# EAGLE design xo106 (EAGLE 7.7.0)
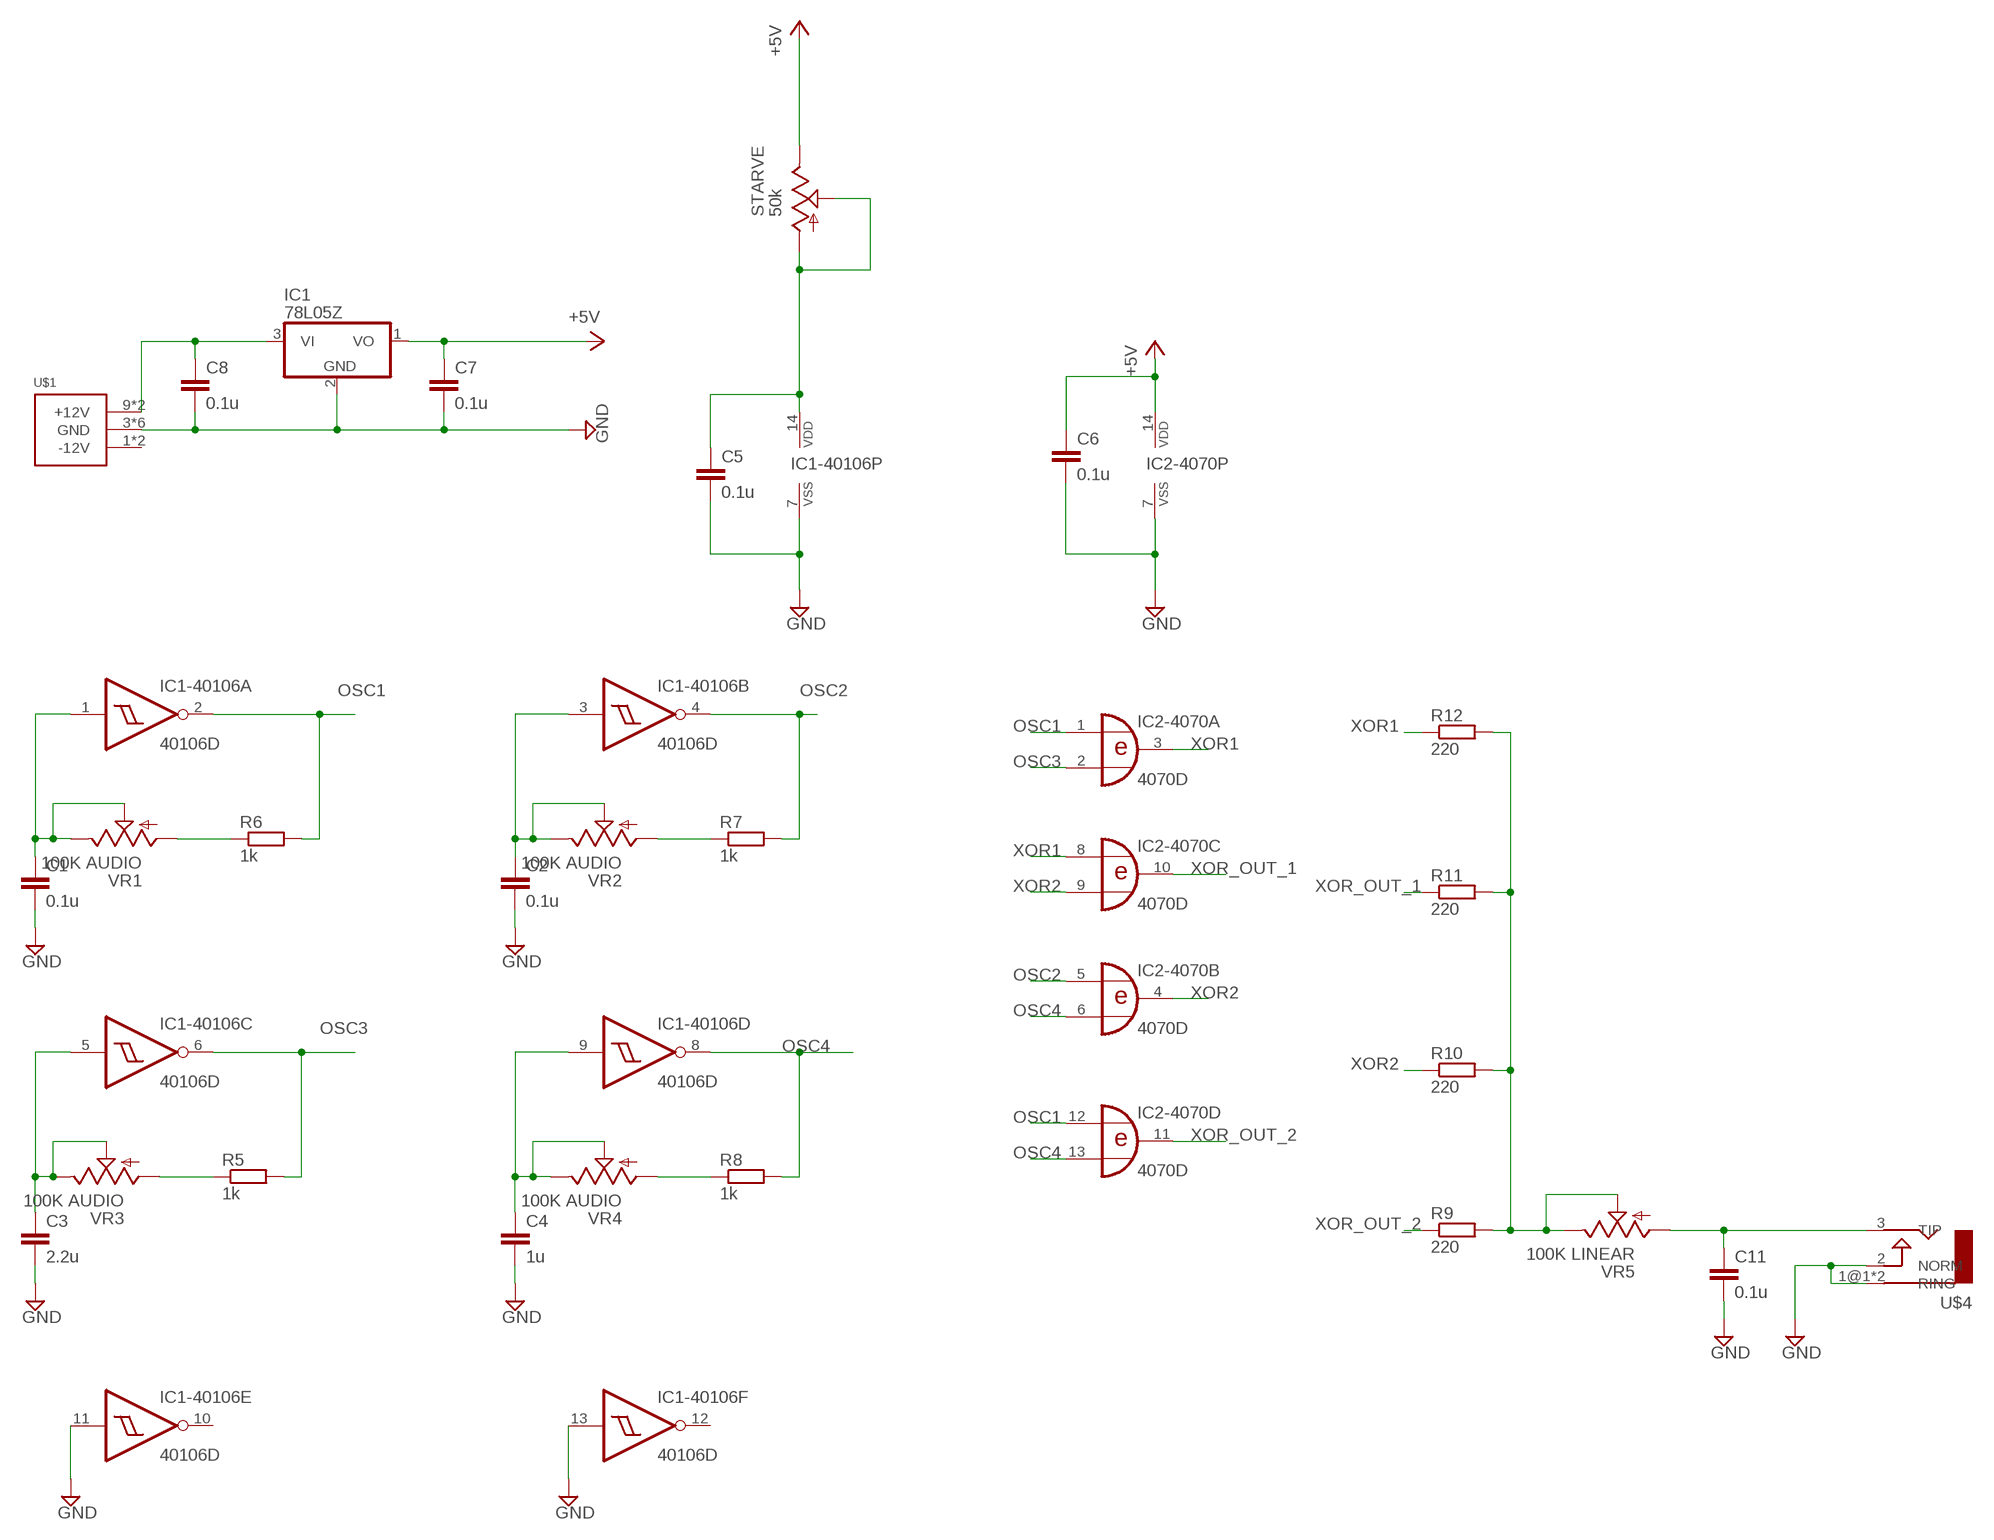
[diagram p0: schematic, sheet 1]

## Parts
C1  0.1u  C-EUC0805  [C0805]
C2  0.1u  C-EUC0805  [C0805]
C3  2.2u  C-EUC0805  [C0805]
C4  1u  C-EUC0805  [C0805]
C5  0.1u  C-EUC0805  [C0805]
C6  0.1u  C-EUC0805  [C0805]
C7  0.1u  C-EUC0805  [C0805]
C8  0.1u  C-EUC0805  [C0805]
C11  0.1u  C-EU050-025X075  [C050-025X075]
IC1  78L05Z  [TO92]
IC1-40106  40106D  [SO14]
IC2-4070  4070D  [SO14]
R5  1k  R-EU_R0805  [R0805]
R6  1k  R-EU_R0805  [R0805]
R7  1k  R-EU_R0805  [R0805]
R8  1k  R-EU_R0805  [R0805]
R9  220  R-EU_R0805  [R0805]
R10  220  R-EU_R0805  [R0805]
R11  220  R-EU_R0805  [R0805]
R12  220  R-EU_R0805  [R0805]
STARVE  50k  9MM_SNAP-IN_POT_  [9MM_SNAP-IN_POT]
U$1  POWER_SIMPLE10  [POWER_10]
U$4  AUDIO-JACKERTHENVAR  [ERTHENVAR-JACK]
VR1  100K AUDIO  9MM_SNAP-IN_POT_  [9MM_SNAP-IN_POT]
VR2  100K AUDIO  9MM_SNAP-IN_POT_  [9MM_SNAP-IN_POT]
VR3  100K AUDIO  9MM_SNAP-IN_POT_  [9MM_SNAP-IN_POT]
VR4  100K AUDIO  9MM_SNAP-IN_POT_  [9MM_SNAP-IN_POT]
VR5  100K LINEAR  9MM_SNAP-IN_POT_  [9MM_SNAP-IN_POT]

## Nets
+5V: C6.1 C7.1 IC1.1(VO) IC2-4070.14(P:VDD) STARVE.3(E)
GND: C1.2 C2.2 C3.2 C4.2 C5.2 C6.2 C7.2 C8.2 C11.2 IC1-40106.7(P:VSS) IC1-40106.11(E:I) IC1-40106.13(F:I) IC1.2(GND) IC2-4070.7(P:VSS) U$1.3(GND) U$1.4(GND) U$1.5(GND) U$1.6(GND) U$1.7(GND) U$1.8(GND) U$4.1@1(RING) U$4.1@2(RING) U$4.2(NORM)
N$1: C11.1 U$4.3(TIP) VR5.1(A)
N$2: R6.1 VR1.1(A)
N$3: R5.1 VR3.1(A)
N$4: R8.1 VR4.1(A)
N$5: C1.1 IC1-40106.1(A:I) VR1.2(S) VR1.3(E)
N$6: C2.1 IC1-40106.3(B:I) VR2.2(S) VR2.3(E)
N$7: C3.1 IC1-40106.5(C:I) VR3.2(S) VR3.3(E)
N$8: C4.1 IC1-40106.9(D:I) VR4.2(S) VR4.3(E)
N$9: R7.1 VR2.1(A)
N$10: C8.1 IC1.3(VI) U$1.9(+12V) U$1.10(+12V)
N$11: C5.1 IC1-40106.14(P:VDD) STARVE.1(A) STARVE.2(S)
N$15: R9.2 R10.2 R11.2 R12.2 VR5.2(S) VR5.3(E)
OSC1: IC1-40106.2(A:O) IC2-4070.1(A:I0) IC2-4070.12(D:I0) R6.2
OSC2: IC1-40106.4(B:O) IC2-4070.5(B:I0) R7.2
OSC3: IC1-40106.6(C:O) IC2-4070.2(A:I1) R5.2
OSC4: IC1-40106.8(D:O) IC2-4070.6(B:I1) IC2-4070.13(D:I1) R8.2
XOR1: IC2-4070.3(A:O) IC2-4070.8(C:I0) R12.1
XOR2: IC2-4070.4(B:O) IC2-4070.9(C:I1) R10.1
XOR_OUT_1: IC2-4070.10(C:O) R11.1
XOR_OUT_2: IC2-4070.11(D:O) R9.1
Unconnected: IC1-40106.10(E:O) IC1-40106.12(F:O) U$1.1(-12V) U$1.2(-12V)

## Library data of the parts
C1-C8 C11 = rcl:C-EU: CAPACITOR, European symbol
IC1 = linear:78*: Positive VOLTAGE REGULATOR Source: http://cache.national.com/ds/LM/LM78L05.pdf http://www.fairchildsemi.com/ds/LM/LM7805.pdf
IC1-40106 = 40xx:40106: Hex SCHMITT TRIGGER
IC2-4070 = 40xx:4070: Quad 2-input XOR
R5-R12 = resistor:R-EU_: RESISTOR, European symbol
STARVE VR1-VR5 = MusicThingModular:9MM_SNAP-IN_POT: 9mm vertical snap-in pot, Alpha / Panasonic style
U$1 = eurorack:POWER_SIMPLE
U$4 = erthenvar:AUDIO-JACK: Switching Mono 3.5mm Audio Jack from Erthenvar.

## Board
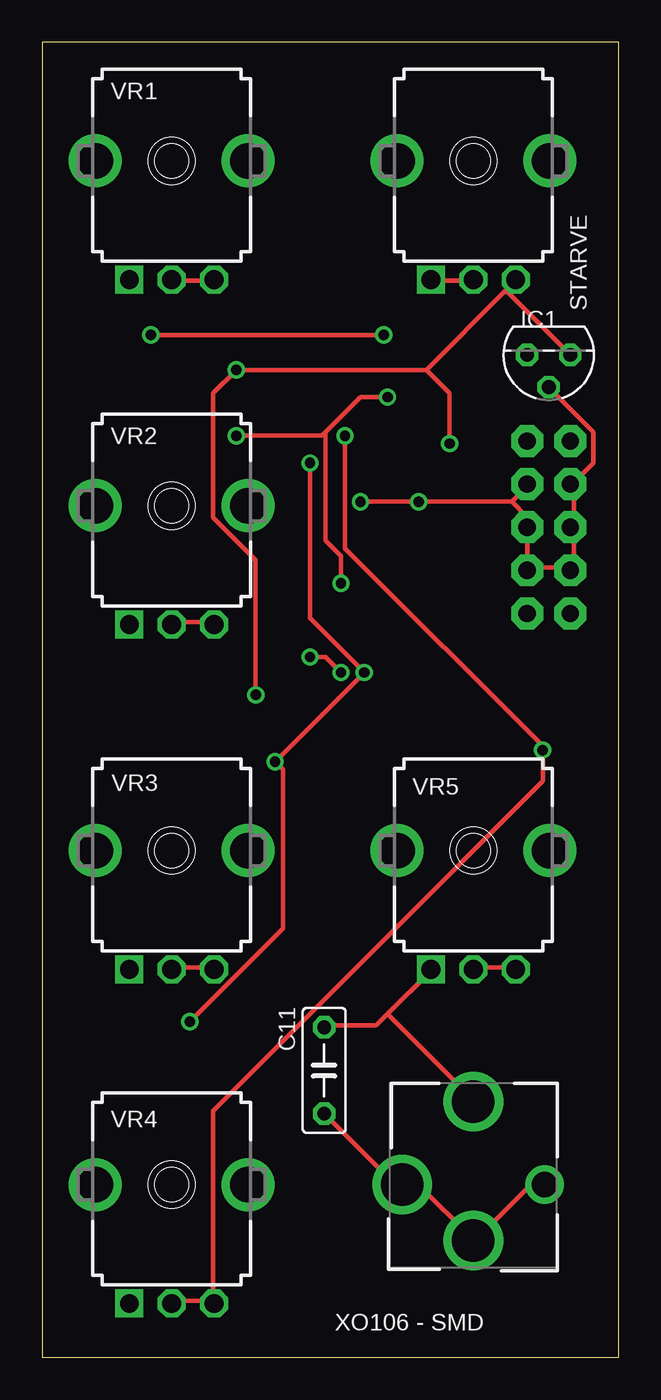
[diagram p1: board, top side]
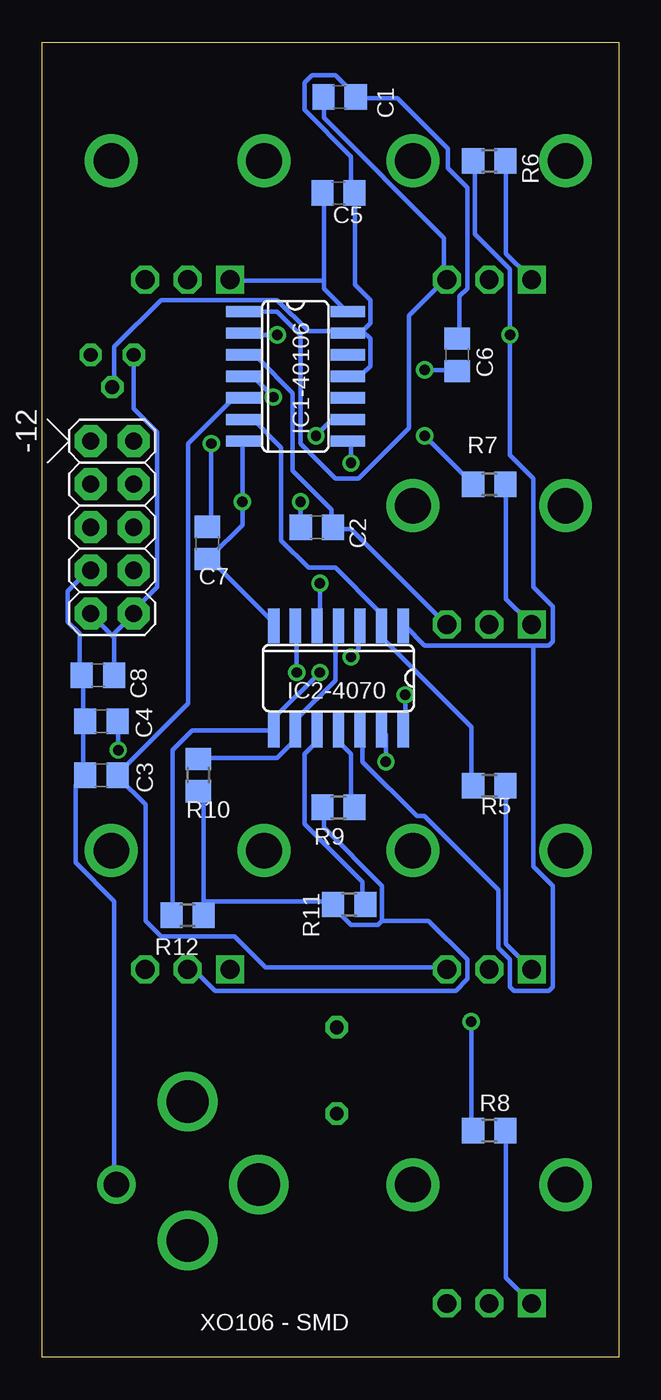
[diagram p2: board, bottom side, seen from below]

Size 33.96 x 77.46 mm. Coordinates in mm from the lower left corner, seen from the top.
Outline: 0,0 33.96,0 33.96,77.46 0,77.46 0,0
Copper layers (1*16): Top 0.035mm / dielectric 1.5mm / Bottom 0.035mm
Design rules "default": minimum track width 10mil, minimum drill 24mil, track to track 8mil, track to pad 8mil, pad to pad 8mil, via to via 8mil, smd to smd 8mil, copper to edge 40mil, drill to drill 8mil, minimum pad ring 10mil, minimum via ring 8mil, stop-mask expansion 4mil, vias tented up to drill 0mil, thermal gap 10mil

### Footprints (pad centres in the part's own frame; a part is rotated, then mirrored left to right if it is on the bottom)
C0805 = smd 1.3 x 1.5: 1 -0.95,0; 2 0.95,0
C050-025X075 = drill 0.813 octagon: 1 -2.54,0; 2 2.54,0
TO92 = drill 0.813 octagon: 1 -1.27,0; 2 0,1.905; 3 1.27,0
SO14 = smd 0.66 x 2.032: 1 -3.81,-3.073; 2 -2.54,-3.073; 3 -1.27,-3.073; 4 0,-3.073; 5 1.27,-3.073; 6 2.54,-3.073; 7 3.81,-3.073; 8 3.81,3.073; 9 2.54,3.073; 10 1.27,3.073; 11 0,3.073; 12 -1.27,3.073; 13 -2.54,3.073; 14 -3.81,3.073
R0805 = smd 1.3 x 1.5: 1 -0.95,0; 2 0.95,0
9MM_SNAP-IN_POT = drill 1.1 square: 1 -2.5,-7 | drill 1.1 octagon: 2 0,-7; 3 2.5,-7 | drill 2.1 pad 2.794: CHASSIS1 -4.5,0; CHASSIS2 4.5,0
POWER_10 = drill 1.016 pad 1.88 octagon: 1 -5.08,-1.27; 2 -5.08,1.27; 3 -2.54,-1.27; 4 -2.54,1.27; 5 0,-1.27; 6 0,1.27; 7 2.54,-1.27; 8 2.54,1.27; 9 5.08,-1.27; 10 5.08,1.27
ERTHENVAR-JACK = drill 2.5: 1@1 -4.2,0; 2 0,-3.3; 3 0,4.9 | drill 1.5: 1@2 4.2,0

### Placement (x,y rotation side)
C1  16.44,74.25 0 bottom
C2  17.78,48.89 180 bottom
C3  30.48,34.29 180 bottom
C4  30.48,37.46 180 bottom
C5  16.51,68.58 0 bottom
C6  9.53,59.05 90 bottom
C7  24.23,47.97 270 bottom
C8  30.69,40.17 180 bottom
C11  16.61,16.89 270 top
IC1  29.84,59.05 180 top
IC1-40106  19.05,57.78 270 bottom
IC2-4070  16.51,40 180 bottom
R5  7.62,33.65 180 bottom
R6  7.62,70.48 180 bottom
R7  7.62,51.43 180 bottom
R8  7.62,13.34 180 bottom
R9  16.51,32.38 180 bottom
R10  24.77,34.29 270 bottom
R11  15.88,26.67 180 bottom
R12  25.4,26.04 0 bottom
STARVE  25.4,70.48 0 top
U$1  29.84,48.89 270 bottom
U$4  25.4,10.16 0 top
VR1  7.62,70.48 0 top
VR2  7.62,50.16 0 top
VR3  7.62,29.84 0 top
VR4  7.62,10.16 0 top
VR5  25.4,29.84 0 top

### Tracks (layer width: path | path; a pad name or v marks a point on that pad's centre or on a via)
+5V  (via drill 0.61)
  Top 0.254: 22.63,58.17 v11.43,58.17 10.06,56.79 10.06,49.48 12.57,46.96 v12.57,39.01 | 27.2,62.74 27.89,63.42 STARVE.3 | 27.2,62.74 22.63,58.17 | v24,53.82 24,56.79 22.63,58.17 | IC1.1 27.43,62.74 27.2,62.74
  Bottom 0.254: v11.43,58.17 9.6,58.17 C6.1 | v24,53.82 24,49.02 C7.1 | v12.57,39.01 12.57,37.13 IC2-4070.14
GND  (via drill 0.61)
  Top 0.254: C11.2 16.69,14.28 20.8,10.16 U$4.1@1 22.17,10.16 25.38,6.96 U$4.2 25.6,6.96 28.8,10.16 U$4.1@2 | 28.57,46.51 U$1.6 28.57,49.48 27.66,50.39 | 27.66,50.39 v22.17,50.39 v18.75,50.39 | 27.66,50.39 28.57,51.31 U$1.4 | IC1.2 29.95,57.02 32.46,54.51 32.46,52.68 31.32,51.54 U$1.3 31.32,51.31 31.32,49.02 U$1.5 31.32,48.79 31.32,46.51 U$1.7 31.09,46.51 28.57,46.51 | 28.57,46.51 U$1.8
  Bottom 0.254: 15.09,60.45 14.63,60.91 14.63,62.28 15.54,63.2 15.54,68.45 C5.2 15.77,68.68 15.77,70.74 18.52,73.48 18.52,75.08 18.06,75.54 16.69,75.54 15.54,74.4 C1.2 15.32,74.17 13.03,74.17 10.06,71.2 10.06,70.05 8.91,68.91 8.91,62.97 9.37,62.51 9.37,60.22 C6.2 | 15.09,60.45 15.77,60.45 IC1-40106.13 | 15.09,60.45 14.63,59.99 14.63,58.39 15.09,57.94 15.77,57.94 IC1-40106.11 | 15.09,60.45 IC1-40106.13 | IC2-4070.7 20.12,43.08 24,46.96 C7.2 24,47.19 22.17,49.02 v22.17,50.39 22.17,53.82 IC1-40106.7 | v18.75,50.39 18.75,49.02 C2.2 | U$1.7 31.32,46.28 32.46,45.14 32.46,43.31 31.77,42.62 31.77,40.33 C8.2 31.55,40.11 31.55,37.59 C4.2 31.55,37.36 31.55,34.39 C3.2 31.55,34.16 32,33.71 32,29.13 29.72,26.85 29.72,10.16 U$4.1@2 | IC1-40106.13 16,60.45 18.29,60.45 20.12,62.28 26.98,62.28 29.72,59.54 29.72,57.25 IC1.2
N$1
  Top 0.254: 20.34,20.22 22.86,22.73 VR5.1 | 20.34,20.22 19.66,19.53 16.69,19.53 C11.1 | 20.34,20.22 25.38,15.19 U$4.3
N$2
  Bottom 0.254: R6.1 6.63,70.28 6.63,65.02 5.26,63.65 VR1.1
N$3
  Bottom 0.254: R5.1 6.63,33.48 6.63,24.33 5.26,22.96 VR3.1
N$4
  Bottom 0.254: R8.1 6.63,13.13 6.63,4.67 5.26,3.3 VR4.1
N$5
  Top 0.254: VR1.2 7.77,63.42 10.06,63.42 VR1.3
  Bottom 0.254: C1.1 17.37,74.17 17.37,73.03 10.29,65.94 10.29,63.65 VR1.3 10.29,63.42 12.34,61.37 12.34,54.74 15.32,51.76 16.69,51.76 18.75,53.82 18.75,60.22 20.12,61.59 IC1-40106.1
N$6
  Top 0.254: VR2.2 7.77,43.31 10.06,43.31 VR2.3
  Bottom 0.254: VR2.3 10.29,43.31 15.77,48.79 16.69,48.79 C2.1 16.92,49.02 16.92,49.94 19.2,52.22 19.2,56.79 21.26,58.85 21.95,58.85 IC1-40106.3
N$7
  Top 0.254: VR3.2 7.77,22.96 10.06,22.96 VR3.3
  Bottom 0.254: IC1-40106.5 22.17,56.34 22.86,56.34 25.38,53.82 25.38,38.51 29.49,34.39 C3.1 29.49,34.16 27.89,32.56 27.89,25.71 26.98,24.79 22.63,24.79 20.8,22.96 10.29,22.96 VR3.3
N$8  (via drill 0.61)
  Top 0.254: 10.06,3.3 10.06,14.5 29.49,33.93 v29.49,35.76 29.49,35.99 17.83,47.65 v17.83,54.28 | 10.06,3.3 7.77,3.3 VR4.2 | 10.06,3.3 VR4.3
  Bottom 0.254: v29.49,35.76 29.49,37.36 C4.1 | v17.83,54.28 16.92,55.19 16,55.19 IC1-40106.9
N$9
  Bottom 0.254: R7.1 6.63,51.31 6.63,44.68 5.26,43.31 VR2.1
N$10
  Bottom 0.254: 29.72,42.39 29.72,42.62 28.57,43.76 U$1.10 28.57,43.99 27.2,45.36 27.2,54.51 28.57,55.88 IC1.3 | 29.72,42.39 29.72,40.33 C8.1 | 29.72,42.39 31.09,43.76 U$1.9
N$11
  Top 0.254: STARVE.1 23.09,63.42 25.38,63.42 STARVE.2
  Bottom 0.254: 17.37,63.42 17.37,62.97 16,61.59 IC1-40106.14 | 17.37,63.42 17.37,68.45 C5.1 | 17.37,63.42 22.86,63.42 STARVE.1
N$15
  Top 0.254: VR5.2 25.6,22.96 27.89,22.96 VR5.3
  Bottom 0.254: 24.46,26.85 24.46,33.02 24.69,33.25 R10.2 | 24.46,26.85 24.46,26.16 R12.2 | 13.95,25.71 13.95,27.76 17.37,31.19 17.37,32.33 R9.2 | 13.95,25.71 14.17,25.48 15.77,25.48 16.92,26.62 R11.2 16.92,26.85 24.46,26.85 | 13.95,25.71 11.2,25.71 8.91,23.42 8.91,22.28 9.6,21.59 23.77,21.59 24.92,22.73 25.38,22.73 VR5.2
OSC1  (via drill 0.61)
  Top 0.254: v6.4,60.22 v20.12,60.22
  Bottom 0.254: 5.03,41.93 11.43,41.93 12.57,43.08 IC2-4070.1 | 5.03,41.93 4.12,41.93 3.89,42.16 3.89,44.22 5.03,45.36 5.03,51.76 6.4,53.14 v6.4,60.22 6.4,64.11 8.46,66.17 8.46,70.28 R6.2 | 5.03,41.93 5.03,28.91 3.89,27.76 3.89,21.82 4.12,21.59 6.17,21.59 6.4,21.82 6.4,23.42 7.09,24.11 7.09,27.53 11.43,31.88 11.89,31.88 15.09,35.08 15.09,36.91 IC2-4070.12 | v20.12,60.22 21.95,60.22 IC1-40106.2
OSC2  (via drill 0.61)
  Top 0.254: v11.43,54.28 16.46,54.28 16.69,54.51 | 16.69,54.51 18.75,56.57 v20.34,56.57 | v17.6,45.59 17.6,47.19 16.69,48.11 16.69,54.51
  Bottom 0.254: v11.43,54.28 8.69,51.54 R7.2 | v20.34,56.57 21.49,57.71 21.95,57.71 IC1-40106.4 | v17.6,45.59 17.6,43.08 IC2-4070.5
OSC3
  Bottom 0.254: R5.2 8.69,33.71 8.69,37.13 13.95,42.39 13.95,43.08 IC2-4070.2 14.17,43.08 14.17,43.99 16.69,46.51 18.29,46.51 19.89,48.11 19.89,53.59 21.49,55.19 21.95,55.19 IC1-40106.6
OSC4  (via drill 0.61)
  Top 0.254: v8.69,19.76 14.17,25.25 14.17,34.62 v13.72,35.08 v18.97,40.33 15.77,43.54 v15.77,52.68
  Bottom 0.254: v8.69,19.76 8.69,13.36 R8.2 | v13.72,35.08 13.72,36.68 IC2-4070.13 | v18.97,40.33 18.97,43.08 IC2-4070.6 | v15.77,52.68 15.77,53.82 IC1-40106.8
XOR1  (via drill 0.61)
  Top 0.254: v15.77,41.25 16.69,41.25 v17.6,40.33
  Bottom 0.254: R12.1 26.29,26.16 26.29,35.76 25.15,36.91 20.34,36.91 IC2-4070.8 20.12,37.13 20.12,37.82 v17.6,40.33 | v15.77,41.25 15.32,41.71 15.32,43.08 IC2-4070.3
XOR2
  Bottom 0.254: R10.1 24.69,35.31 20.12,35.31 19.2,36.22 19.2,36.91 IC2-4070.9 18.97,37.13 18.97,37.59 16.69,39.88 16.69,43.08 IC2-4070.4
XOR_OUT_1
  Bottom 0.254: R11.1 15.09,26.85 15.09,27.99 18.52,31.42 18.52,35.53 17.83,36.22 17.83,36.91 IC2-4070.10
XOR_OUT_2
  Bottom 0.254: R9.1 15.77,32.56 15.77,35.53 16.46,36.22 16.46,36.91 IC2-4070.11

### Text on the board
tNames: XO106 - SMD
bNames: XO106 - SMD